# EAGLE schematic Template (EAGLE 7.7.0)
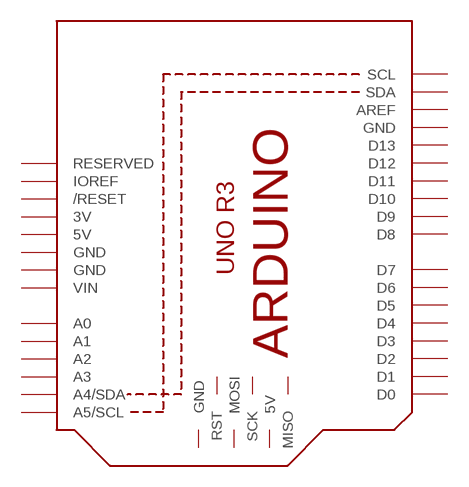
[diagram p0: schematic, sheet 1]

## Parts
M1  ARDUINO_R3_ICSP  [ARDUINOR3_ICSP]
Unconnected: M1.5V_ICSP(5V) M1.A0 M1.A1 M1.A2 M1.A3 M1.A4(A4/SDA) M1.A5(A5/SCL) M1.AREF M1.D0 M1.D1 M1.D2 M1.D3 M1.D4 M1.D5 M1.D6 M1.D7 M1.D8 M1.D9 M1.D10 M1.D11 M1.D12 M1.D13 M1.GND@2(GND) M1.IOREF M1.MISO M1.MOSI M1.RESERVED M1.RESET(/RESET) M1.RESET_ICSP(RST) M1.SCK M1.SCL M1.SDA

## Power pins joined to a net without a drawn wire
3V: M1.3V
5V: M1.5V
GND: M1.GND M1.GND@1(GND) M1.GND@3(GND)
VIN: M1.VIN

## Library data of the parts
M1 = adafruit:ARDUINO_R3_ICSP